# EAGLE design main (EAGLE 9.6.2)
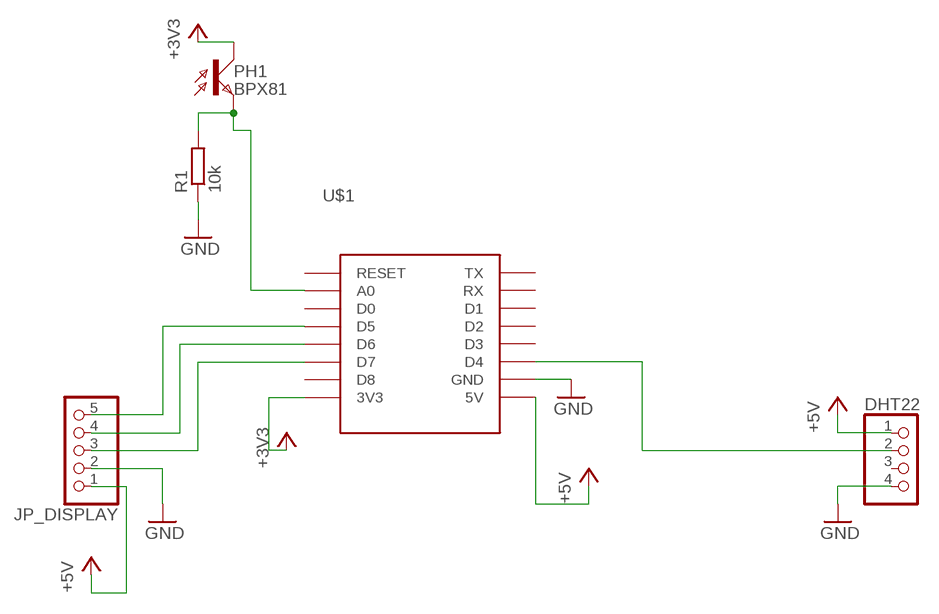
[diagram p0: schematic, sheet 1]

## Parts
DHT22  PINHD-1X4/90  [1X04/90]
JP_DISPLAY  PINHD-1X5/90  [1X05/90]
PH1  BPX81  [BPX81]
R1  10k  R-EU_R0805  [R0805]
U$1  WEMOS-D1-MINI  [WEMOS-D1-MINI]

## Nets
+3V3: PH1.C U$1.3V3
+5V: DHT22.1 JP_DISPLAY.1 U$1.5V
GND: DHT22.4 JP_DISPLAY.2 R1.1 U$1.GND
N$2: PH1.E R1.2 U$1.A0
N$6: DHT22.2 U$1.D4
N$9: JP_DISPLAY.3 U$1.D7
N$10: JP_DISPLAY.4 U$1.D6
N$11: JP_DISPLAY.5 U$1.D5
Unconnected: DHT22.3 U$1.D0 U$1.D1 U$1.D2 U$1.D3 U$1.D8 U$1.RESET U$1.RX U$1.TX

## Library data of the parts
DHT22 = pinhead:PINHD-1X4: PIN HEADER
JP_DISPLAY = pinhead:PINHD-1X5: PIN HEADER
PH1 = opto-trans-siemens:BPX81: PHOTO TRANSISTOR; OC_FARNELL: unknown; OC_NEWARK: unknown
R1 = resistor:R-EU_: RESISTOR, European symbol
U$1 = esp8266modules:WEMOS-D1-MINI: WeMos.cc D1 mini ESP8266 module

## Board
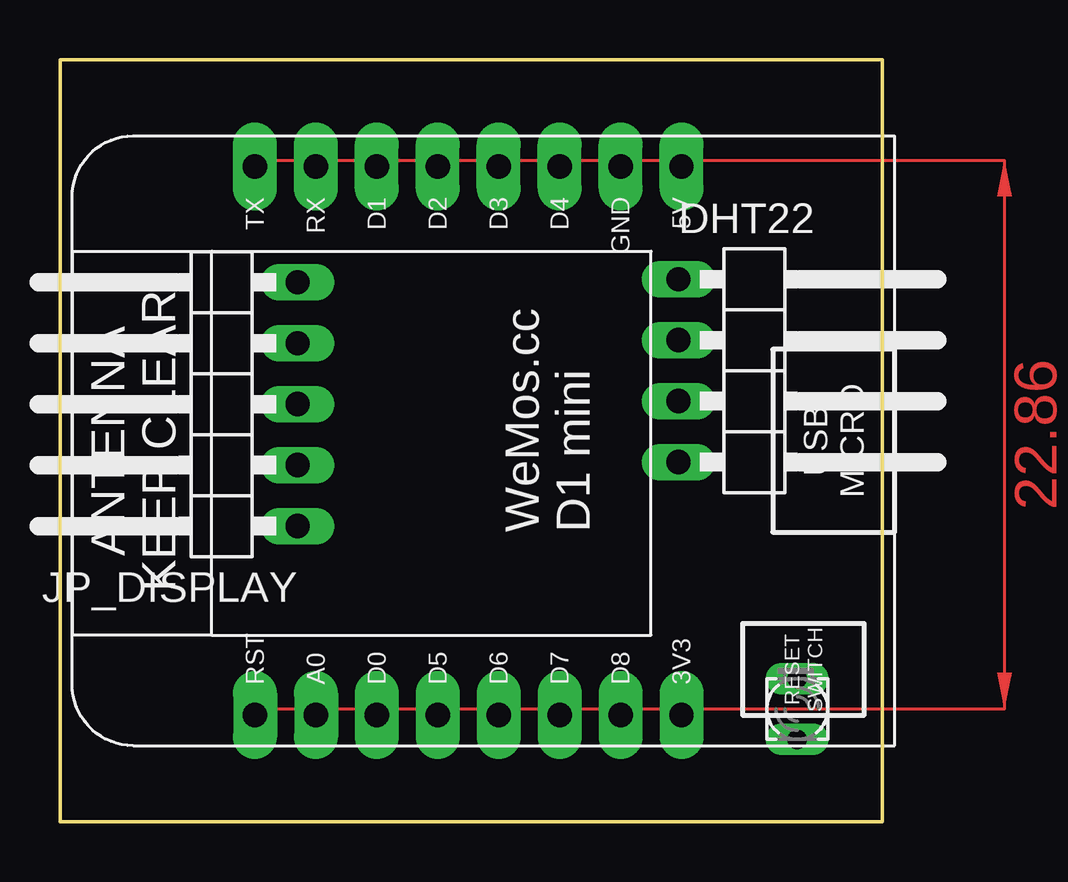
[diagram p1: board, top side]
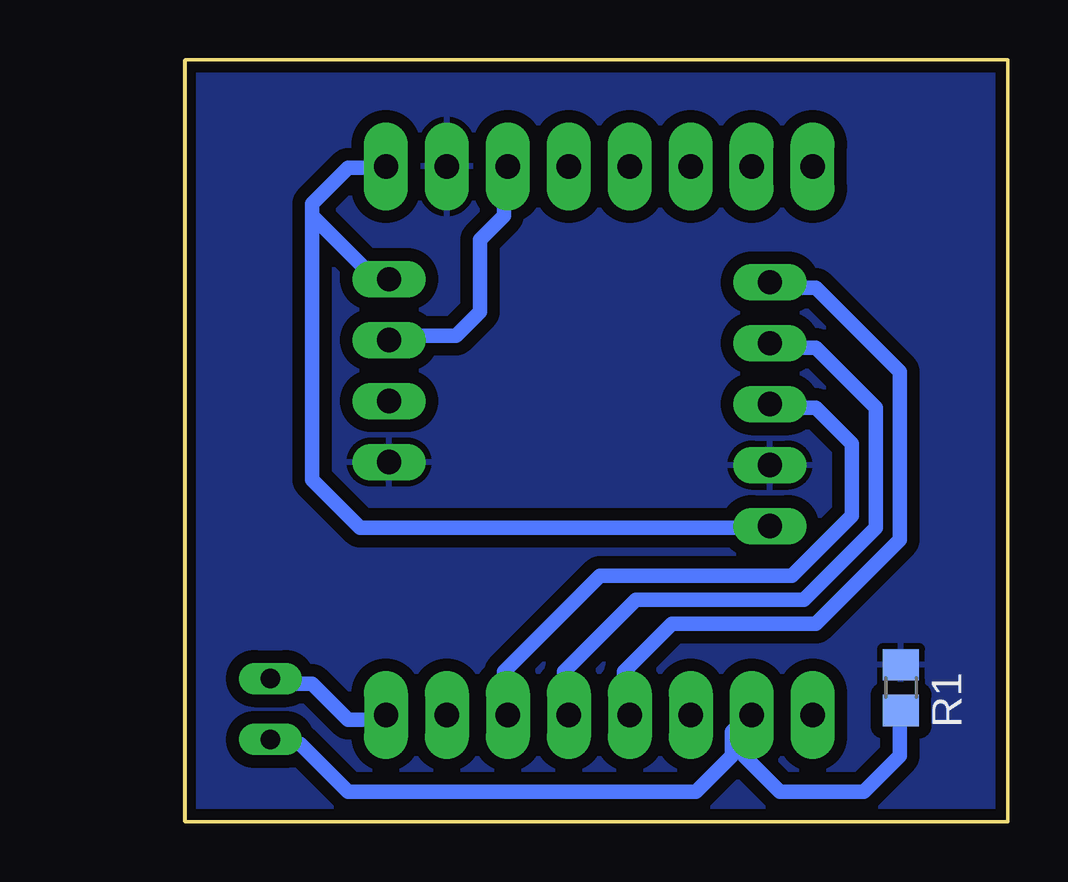
[diagram p2: board, bottom side, seen from below]

Size 34.34 x 31.74 mm. Coordinates in mm from the lower left corner, seen from the top.
Outline: 0,0 34.34,0 34.34,31.74 0,31.74 0,0
Copper layers (1*16): Top 0.035mm / dielectric 1.5mm / Bottom 0.035mm
Design rules "corexy_DRC": minimum track width 0.6mm, minimum drill 0.35mm, track to track 0.4mm, track to pad 0.4mm, pad to pad 0.4mm, via to via 0.4mm, smd to smd 0.4mm, copper to edge 0.4mm, drill to drill 0.4mm, minimum pad ring 10mil, minimum via ring 8mil, stop-mask expansion 4mil, vias tented up to drill 0mil, thermal gap 10mil
Milling: 4 lines

### Footprints (pad centres in the part's own frame; a part is rotated, then mirrored left to right if it is on the bottom)
1X04/90 = drill 1.016 long: 1 -3.81,-3.81; 2 -1.27,-3.81; 3 1.27,-3.81; 4 3.81,-3.81
1X05/90 = drill 1.016 long: 1 -5.08,-3.81; 2 -2.54,-3.81; 3 0,-3.81; 4 2.54,-3.81; 5 5.08,-3.81
BPX81 = drill 0.813 long: C 1.27,0; E -1.27,0
R0805 = smd 1.3 x 1.5: 1 -0.95,0; 2 0.95,0
WEMOS-D1-MINI = drill 1.016 pad 1.829 long: 3V3 -10.16,-10.16; 5V 12.7,-10.16; A0 -10.16,5.08; D0 -10.16,2.54; D1 12.7,2.54; D2 12.7,0; D3 12.7,-2.54; D4 12.7,-5.08; D5 -10.16,0; D6 -10.16,-2.54; D7 -10.16,-5.08; D8 -10.16,-7.62; GND 12.7,-7.62; RESET -10.16,7.62; RX 12.7,5.08; TX 12.7,7.62

### Placement (x,y rotation side)
DHT22  29.59,18.8 270 top
JP_DISPLAY  6.1,17.4 90 top
PH1  30.73,4.7 90 top
R1  4.45,5.59 270 bottom
U$1  15.75,14.61 90 top

### Tracks (layer width: path | path; a pad name or v marks a point on that pad's centre or on a via)
+3V3
  Bottom 0.6: PH1.C 30.5,5.75 29,5.75 27.5,4.25 26,4.25 U$1.3V3
+5V
  Bottom 0.6: 29,25.25 29,25.75 27.5,27.25 26,27.25 U$1.5V | 29,25.25 29,14.25 27,12.25 10,12.25 JP_DISPLAY.1 | 29,25.25 26.5,22.75 26,22.75 DHT22.1
GND
  pour Bottom (isolate 0.525, rank 6): 0,0 0,31.75 34.29,31.75 34.29,0
N$2
  Bottom 0.6: 11,4.25 11,2.75 9.5,1.25 6,1.25 4.5,2.75 4.5,4.25 R1.2 | 11,4.25 11.5,3.75 11.5,2.75 13,1.25 27.5,1.25 29.5,3.25 30.5,3.25 PH1.E | 11,4.25 U$1.A0
N$6
  Bottom 0.6: DHT22.2 25.5,20.25 23,20.25 22,21.25 22,24.25 21,25.25 21,27.25 U$1.D4
N$9
  Bottom 0.6: JP_DISPLAY.3 9.5,17.25 8,17.25 6.5,15.75 6.5,12.75 9,10.25 17,10.25 21,6.25 21,4.75 U$1.D7
N$10
  Bottom 0.6: JP_DISPLAY.4 9.5,19.75 8,19.75 5.5,17.25 5.5,12.25 8.5,9.25 15.5,9.25 18.5,6.25 18.5,4.75 U$1.D6
N$11
  Bottom 0.6: JP_DISPLAY.5 9.5,22.25 8,22.25 4.5,18.75 4.5,11.75 8,8.25 14,8.25 16,6.25 16,4.75 U$1.D5
(copper drawn outside any net)
  shapes: Top area x1